# Altium schematic sheet Sheet1.SchDoc
size A4; SheetNumber: 1; SheetTotal: 2
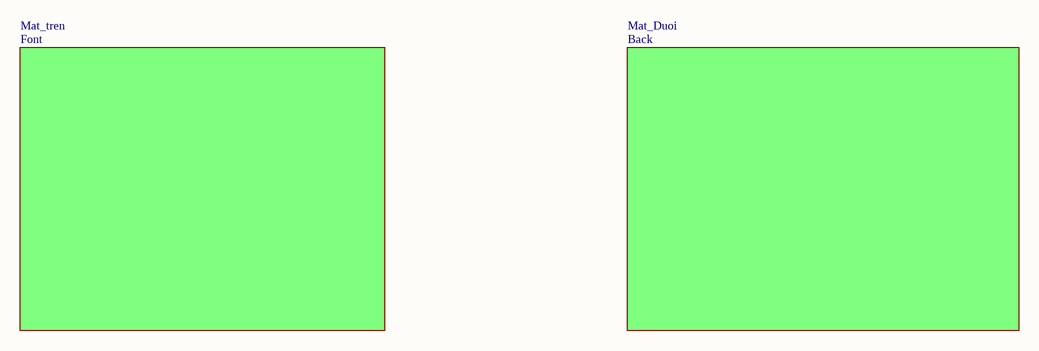
[diagram p0: Sheet1.SchDoc]

## Sub-sheets
Mat_Duoi = Back: no entries
Mat_tren = Font: no entries